# Altium schematic sheet CON_CAN_DB9M.SchDoc: CAN Connector DB9 Male
size A4; Organization: Altium Limited.; Address1: Level 3, 12a Rodborough Rd; Address2: Frenchs Forest 2086; Address3: NSW; Address4: AUSTRALIA; Revision: 6; SheetNumber: 1; SheetTotal: 100
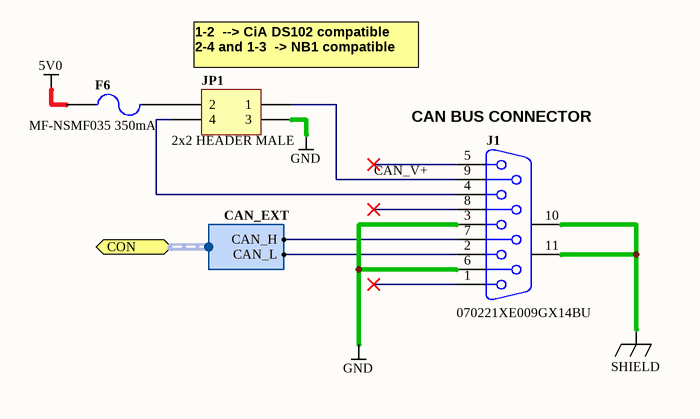
[diagram p0: CON_CAN_DB9M.SchDoc]

## Parts
F6  MF-NSMF035 350mA  [RESC3216]
J1  070221XE009GX14BU  [070221XE009GX14BU]
JP1  2x2 HEADER MALE  [HDR2X2]

## Ports
CON (harness CAN_EXT)

## Harnesses
CAN_EXT: CAN_H, CAN_L

## Nets
5V0: F6.1
GND: J1.3 J1.6 JP1.3
SHIELD: J1.10(MH1) J1.11(MH2)
CAN_V+: J1.9 JP1.1
NetF6_2: F6.2 JP1.2
NetJ1_2: J1.2 ; port CON.CAN_L
NetJ1_4: J1.4 JP1.4
NetJ1_7: J1.7 ; port CON.CAN_H

Not connected (* = marked no-connect by the designer): J1 1* 5* 8*

## Notes on the sheet
- (near JP1) 1-2  --> CiA DS102 compatible
  2-4 and 1-3  -> NB1 compatible
- (near J1) CAN BUS CONNECTOR
- Sheet Title
- Project Title
- Size:
- Date:
- A4
- Assy:
- Time:
- Revision:
- Sheet
- of
- File:

## Library data of the parts
F6 = D-106-0001: Multifuse, SMD 1206, 350mA; Rated Voltage: 6 V; Amperage: 350 mA; Category: Fuse
J1 = D-300-0060: Connector DB9 SMD Male/Pins; SUYIN; Connector type: Header; Max Current: mA; Category: Connector; Mounting Technology: Surface Mount; Status: Unreleased
JP1 = D-300-0019: Header IDC, 2 x 2 Pin Vertical 2.54mm Pitch (Non-Boxed, Male); Max Current: 3 A; Category: Connector; Connector type: Header; Mounting Technology: Through-Hole; Pin Count: 4; Status: Production